# Altium project Nails_project_v2.PrjPcb
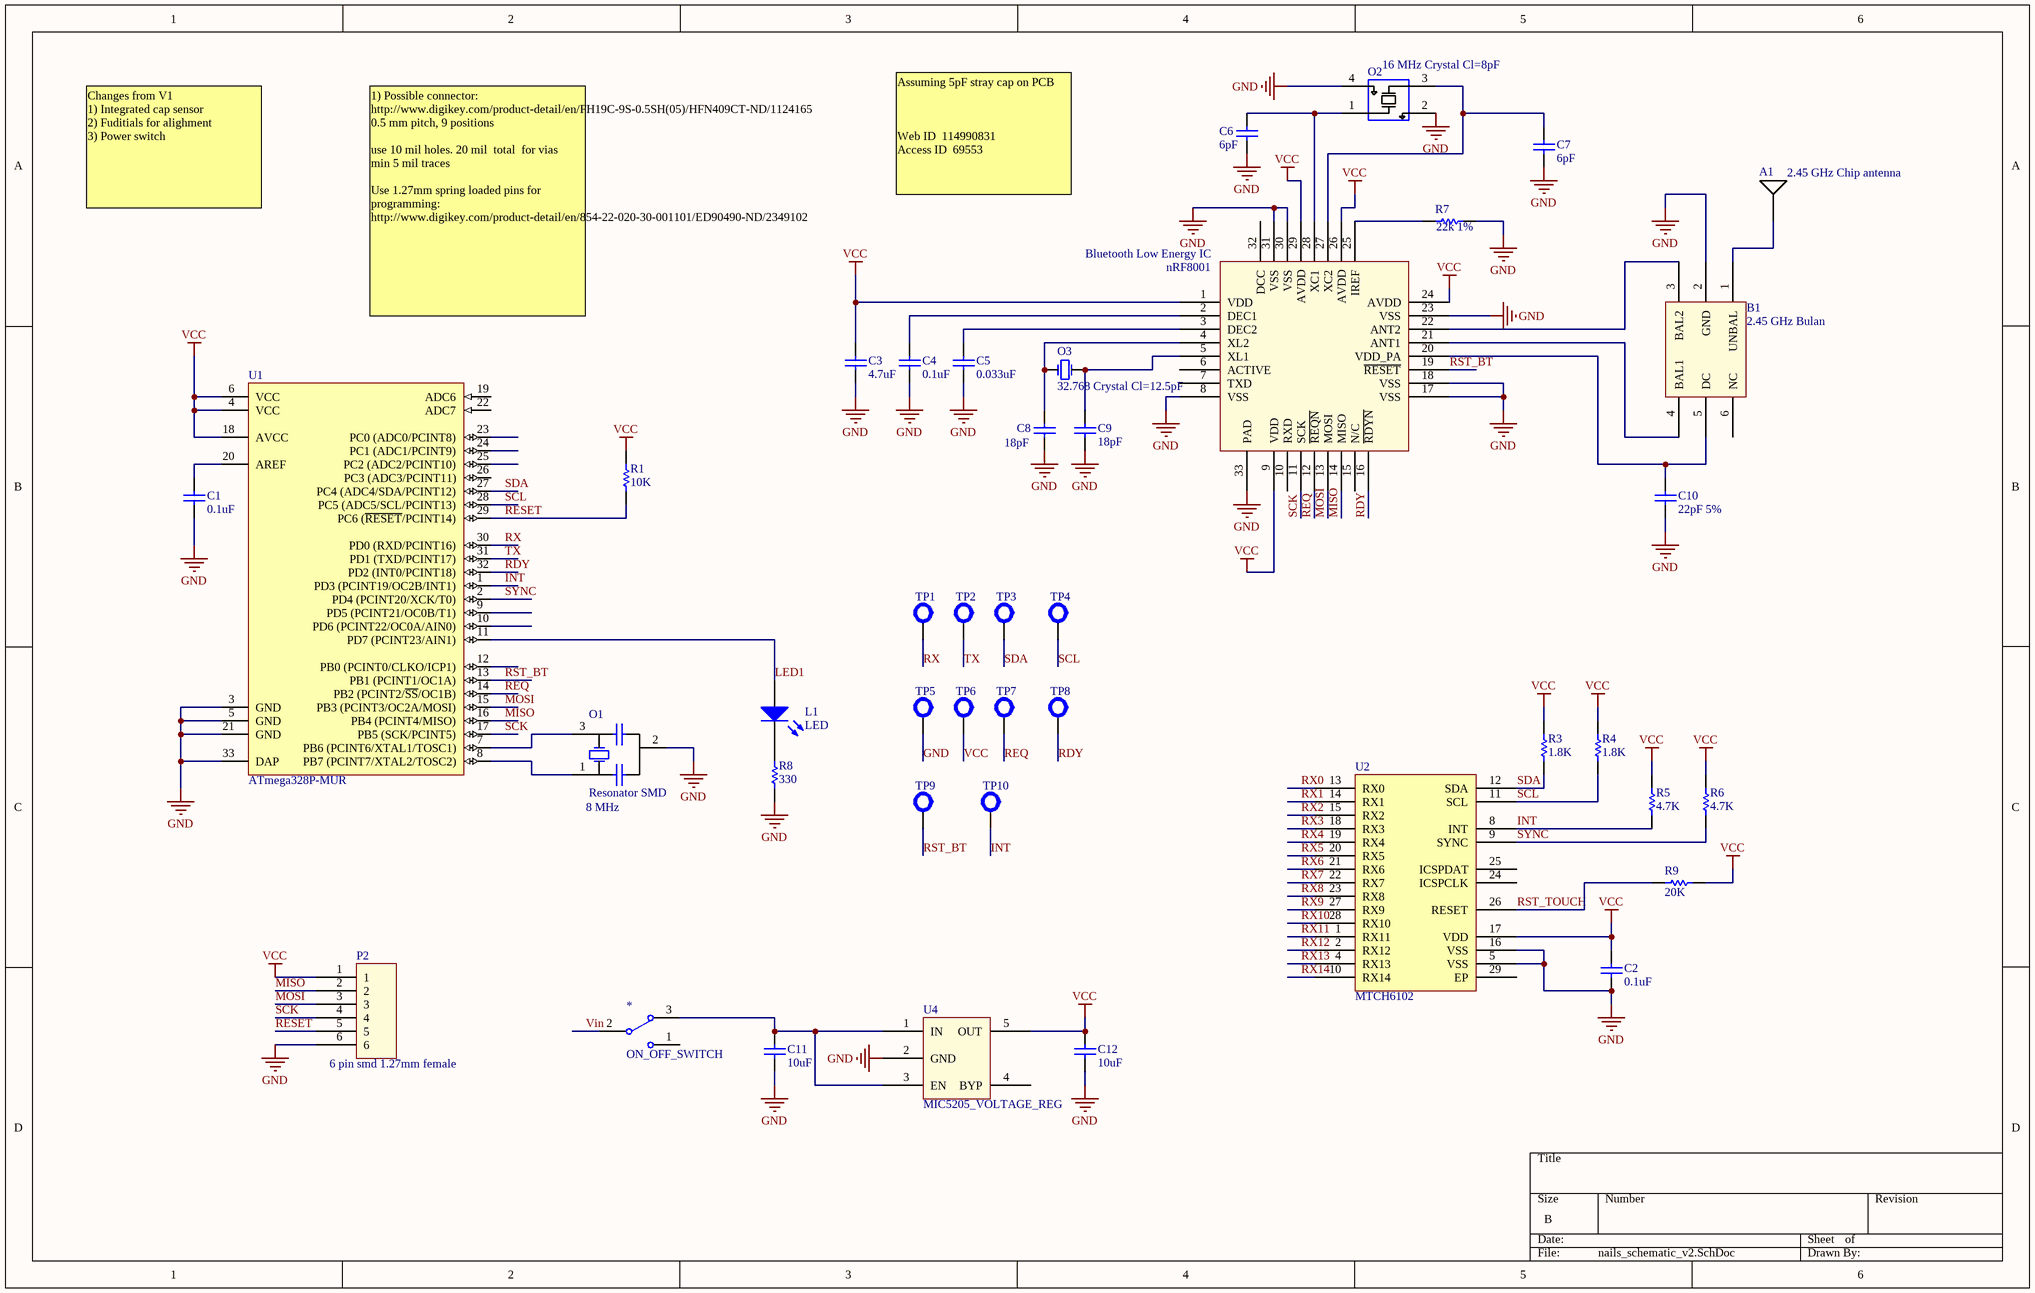
[diagram p0: nails_schematic_v2.SchDoc]
1 sheet, 42 parts. Net scope: global (net labels, ports and power ports of the same name join across sheets).
Board files: nails_PCB_v2_diamond_3x3_no_ground.PcbDoc, nails_PCB_v2.PcbDoc, nails_PCB_v2_panelized.PcbDoc, nails_PCB_v2_diamond_3x3_ground_plane.PcbDoc, nails_PCB_v2_diamond_4x4_ground_plane.PcbDoc, nails_PCB_v2_diamond_4x4_no_ground_plane.PcbDoc, PCB_sensor_tape_v2.PcbDoc

## Sheet nails_schematic_v2.SchDoc
size B

### Parts
*  ON_OFF_SWITCH  [SWTICH_SMD_SIDE]
A1  2.45 GHz Chip antenna  [2450AT18A100E]
B1  2.45 GHz Bulan  [2450BM14A0002]
Bluetooth_Low_Energy_IC  nRF8001  [QFN32_W_GND]
C1  0.1uF  [0402W]
C2  0.1uF  [0402W]
C3  4.7uF  [0402W]
C4  0.1uF  [0402W]
C5  0.033uF  [0402W]
C6  6pF  [0402W]
C7  6pF  [0402W]
C8  18pF  [0402W]
C9  18pF  [0402W]
C10  22pF 5%  [0402W]
C11  10uF  [0402W]
C12  10uF  [0402W]
L1  LED  [0402W]
O1  Resonator SMD  [Resonator SMD]
O2  16 MHz Crystal Cl=8pF  [2.5 x 2.0 crystal]
O3  32.768 Crystal Cl=12.5pF  [32.768 Crystal]
P2  6 pin smd 1.27mm female  [6pos 1.27mm]
R1  10K  [0402W]
R3  1.8K  [0402W]
R4  1.8K  [0402W]
R5  4.7K  [0402W]
R6  4.7K  [0402W]
R7  22k 1%  [0402W]
R8  330  [0402W]
R9  20K  [0402W]
TP1  Test point small  [TEST POINT SMD SUPER SMALL]  (value not drawn)
TP2  Test point small  [TEST POINT SMD SUPER SMALL]  (value not drawn)
TP3  Test point small  [TEST POINT SMD SUPER SMALL]  (value not drawn)
TP4  Test point small  [TEST POINT SMD SUPER SMALL]  (value not drawn)
TP5  Test point small  [TEST POINT SMD SUPER SMALL]  (value not drawn)
TP6  Test point small  [TEST POINT SMD SUPER SMALL]  (value not drawn)
TP7  Test point small  [TEST POINT SMD SUPER SMALL]  (value not drawn)
TP8  Test point small  [TEST POINT SMD SUPER SMALL]  (value not drawn)
TP9  Test point small  [TEST POINT SMD SUPER SMALL]  (value not drawn)
TP10  Test point small  [TEST POINT SMD SUPER SMALL]  (value not drawn)
U1  ATmega328P-MUR  [32M1-A_M]
U2  MTCH6102  [QFN28_no_gnd_conn]
U4  MIC5205_VOLTAGE_REG  [SOT-23-5]

### Nets
GND: B1.2(GND) Bluetooth_Low_Energy_IC.8(VSS) Bluetooth_Low_Energy_IC.17(VSS) Bluetooth_Low_Energy_IC.18(VSS) Bluetooth_Low_Energy_IC.23(VSS) Bluetooth_Low_Energy_IC.30(VSS) Bluetooth_Low_Energy_IC.31(VSS) Bluetooth_Low_Energy_IC.33(PAD) C1.1 C2.1 C3.1 C4.1 C5.1 C6.1 C7.1 C8.1 C9.1 C10.1 C11.1 C12.1 O1.2 O2.2(Gnd) O2.4(Gnd) P2.6 R7.1 R8.1 TP5.0 U1.3(GND) U1.5(GND) U1.21(GND) U1.33(DAP) U2.5(VSS) U2.16(VSS) U4.2(GND)
VCC: Bluetooth_Low_Energy_IC.1(VDD) Bluetooth_Low_Energy_IC.9(VDD) Bluetooth_Low_Energy_IC.24(AVDD) Bluetooth_Low_Energy_IC.26(AVDD) Bluetooth_Low_Energy_IC.29(AVDD) C2.2 C3.2 C12.2 P2.1 R1.2 R3.2 R4.2 R5.2 R6.2 R9.1 TP6.0 U1.4(VCC) U1.6(VCC) U1.18(AVCC) U2.17(VDD) U4.5(OUT)
INT: R5.1 TP10.0 U1.1(PD3_(PCINT19/OC2B/INT1)) U2.8(INT)
LED1: L1.1(A) U1.11(PD7_(PCINT23/AIN1))
MISO: Bluetooth_Low_Energy_IC.14(MISO) P2.2 U1.16(PB4_(PCINT4/MISO))
MOSI: Bluetooth_Low_Energy_IC.13(MOSI) P2.3 U1.15(PB3_(PCINT3/OC2A/MOSI))
RDY: Bluetooth_Low_Energy_IC.16(~{RDYN}) TP8.0 U1.32(PD2_(INT0/PCINT18))
REQ: Bluetooth_Low_Energy_IC.12(~{REQN}) TP7.0 U1.14(PB2_(PCINT2/~{SS}/OC1B))
RESET: P2.5 R1.1 U1.29(PC6_(~{RESET}/PCINT14))
RST_BT: Bluetooth_Low_Energy_IC.19(~{RESET}) TP9.0 U1.13(PB1_(PCINT1/OC1A))
RST_TOUCH: R9.2 U2.26(RESET)
RX: TP1.0 U1.30(PD0_(RXD/PCINT16))
RX0: U2.13(RX0)
RX1: U2.14(RX1)
RX2: U2.15(RX2)
RX3: U2.18(RX3)
RX4: U2.19(RX4)
RX5: U2.20(RX5)
RX6: U2.21(RX6)
RX7: U2.22(RX7)
RX8: U2.23(RX8)
RX9: U2.27(RX9)
RX10: U2.28(RX10)
RX11: U2.1(RX11)
RX12: U2.2(RX12)
RX13: U2.4(RX13)
RX14: U2.10(RX14)
SCK: Bluetooth_Low_Energy_IC.11(SCK) P2.4 U1.17(PB5_(SCK/PCINT5))
SCL: R4.1 TP4.0 U1.28(PC5_(ADC5/SCL/PCINT13)) U2.11(SCL)
SDA: R3.1 TP3.0 U1.27(PC4_(ADC4/SDA/PCINT12)) U2.12(SDA)
SYNC: R6.1 U1.2(PD4_(PCINT20/XCK/T0)) U2.9(SYNC)
TX: TP2.0 U1.31(PD1_(TXD/PCINT17))
Vin: *.2
Net*_3: *.3 C11.2 U4.1(IN) U4.3(EN)
NetA1_1: A1.1 B1.1(UNBAL)
NetB1_3: B1.3(BAL2) Bluetooth_Low_Energy_IC.22(ANT2)
NetB1_4: B1.4(BAL1) Bluetooth_Low_Energy_IC.21(ANT1)
NetB1_5: B1.5(DC) Bluetooth_Low_Energy_IC.20(VDD_PA) C10.2
NetBluetooth_Low_Energy_IC_2: Bluetooth_Low_Energy_IC.2(DEC1) C4.2
NetBluetooth_Low_Energy_IC_3: Bluetooth_Low_Energy_IC.3(DEC2) C5.2
NetBluetooth_Low_Energy_IC_4: Bluetooth_Low_Energy_IC.4(XL2) C8.2 O3.1
NetBluetooth_Low_Energy_IC_5: Bluetooth_Low_Energy_IC.5(XL1) C9.2 O3.2
NetBluetooth_Low_Energy_IC_25: Bluetooth_Low_Energy_IC.25(IREF) R7.2
NetBluetooth_Low_Energy_IC_27: Bluetooth_Low_Energy_IC.27(XC2) C7.2 O2.3(XOUT)
NetBluetooth_Low_Energy_IC_28: Bluetooth_Low_Energy_IC.28(XC1) C6.2 O2.1(XIN)
NetC1_2: C1.2 U1.20(AREF)
NetL1_2: L1.2(K) R8.2
NetO1_1: O1.1 U1.8(PB7_(PCINT7/XTAL2/TOSC2))
NetO1_3: O1.3 U1.7(PB6_(PCINT6/XTAL1/TOSC1))

Not connected (* = marked no-connect by the designer): * 1; B1 6(NC); Bluetooth_Low_Energy_IC 6(ACTIVE) 7(TXD) 10(RXD) 15(N/C) 32(DCC); U1 9(PD5_(PCINT21/OC0B/T1)) 10(PD6_(PCINT22/OC0A/AIN0)) 12(PB0_(PCINT0/CLKO/ICP1)) 19(ADC6) 22(ADC7) 23(PC0_(ADC0/PCINT8)) 24(PC1_(ADC1/PCINT9)) 25(PC2_(ADC2/PCINT10)) 26(PC3_(ADC3/PCINT11)); U2 24(ICSPCLK) 25(ICSPDAT) 29(EP); U4 4(BYP)

### Notes on the sheet
- Changes from V1
  1) Integrated cap sensor
  2) Fuditials for alighment
  3) Power switch
- Assuming 5pF stray cap on PCB
  Web ID	 114990831
  Access ID	 69553
- 1) Possible connector:
  http://www.digikey.com/product-detail/en/FH19C-9S-0.5SH(05)/HFN409CT-ND/1124165
  0.5 mm pitch, 9 positions
  use 10 mil holes. 20 mil  total  for vias
  min 5 mil traces
  Use 1.27mm spring loaded pins for programming:
  http://www.digikey.com/product-detail/en/854-22-020-30-001101/ED90490-ND/2349102
- (near O1) 8 MHz

### Library data of the parts
* = ON_OFF_SWITCH: DPDT SMD Side Switch 240 mA at 5V; Sparkfun#: COM-00597
A1 = 2.45 GHz Chip antenna: for Bluetooth; digikey number: 712-1005-1-ND
B1 = 2.45 GHz Bulan: for nRF8001 chip; digikey number: 712-1574-1-ND
C1-C12 = Capacitor: SMD Cap 1206
  C1 C2 C4: digikey number: 1276-1443-1-ND
  C3: digikey number: 445-5947-1-ND
  C5: digikey number: 1276-1177-1-ND
  C6 C7: digikey number: 490-8223-1-ND
  C8 C9: digikey number: 399-8828-1-ND
  C10: digikey number: 1276-1561-1-ND
  C11 C12: digikey number: 1276-1452-1-ND
L1 = LED: LED SMD 1206/0603; digikey number: 511-1615-1-ND
O1 = Resonator SMD: Build in caps; digikey number: 490-1195-1-ND
O2 = 16 MHz Crystal Wireless: For BLE use; digikey number: 644-1169-1-ND
O3 = 32.768 Crystal: digikey number: XC1617CT-ND
R1 R3-R9 = Resistor
  R1: digikey number: 311-10KJRCT-ND
  R3 R4: digikey number: 311-1.8KJRCT-ND
  R5 R6: digikey number: 311-4.7KJRCT-ND
  R7: digikey number: 1276-4143-1-ND
  R8: digikey number: 311-330JRCT-ND
  R9: digikey number: P20.0KLCT-ND
U1 = ATmega328P-MUR: 8-bit AVR Microcontroller, 32KB Flash, 1KB EEPROM, 2KB SRAM, 32-pin MLF, Industrial Grade (-40°C to 85°C); digikey number: ATMEGA328P-MURCT-ND
U4 = MIC5205_VOLTAGE_REG: 5V LDO SMD; Sparkfun #: PRT-1125; digikey number: 576-1259-1-ND
Bluetooth_Low_Energy_IC = nRF8001: digikey number: 1490-1026-ND
P2 = 6 pin smd 1.27mm female: digikey number: ED90490-ND
U2 = MTCH6102: digikey number: MTCH6102-I/MV-ND